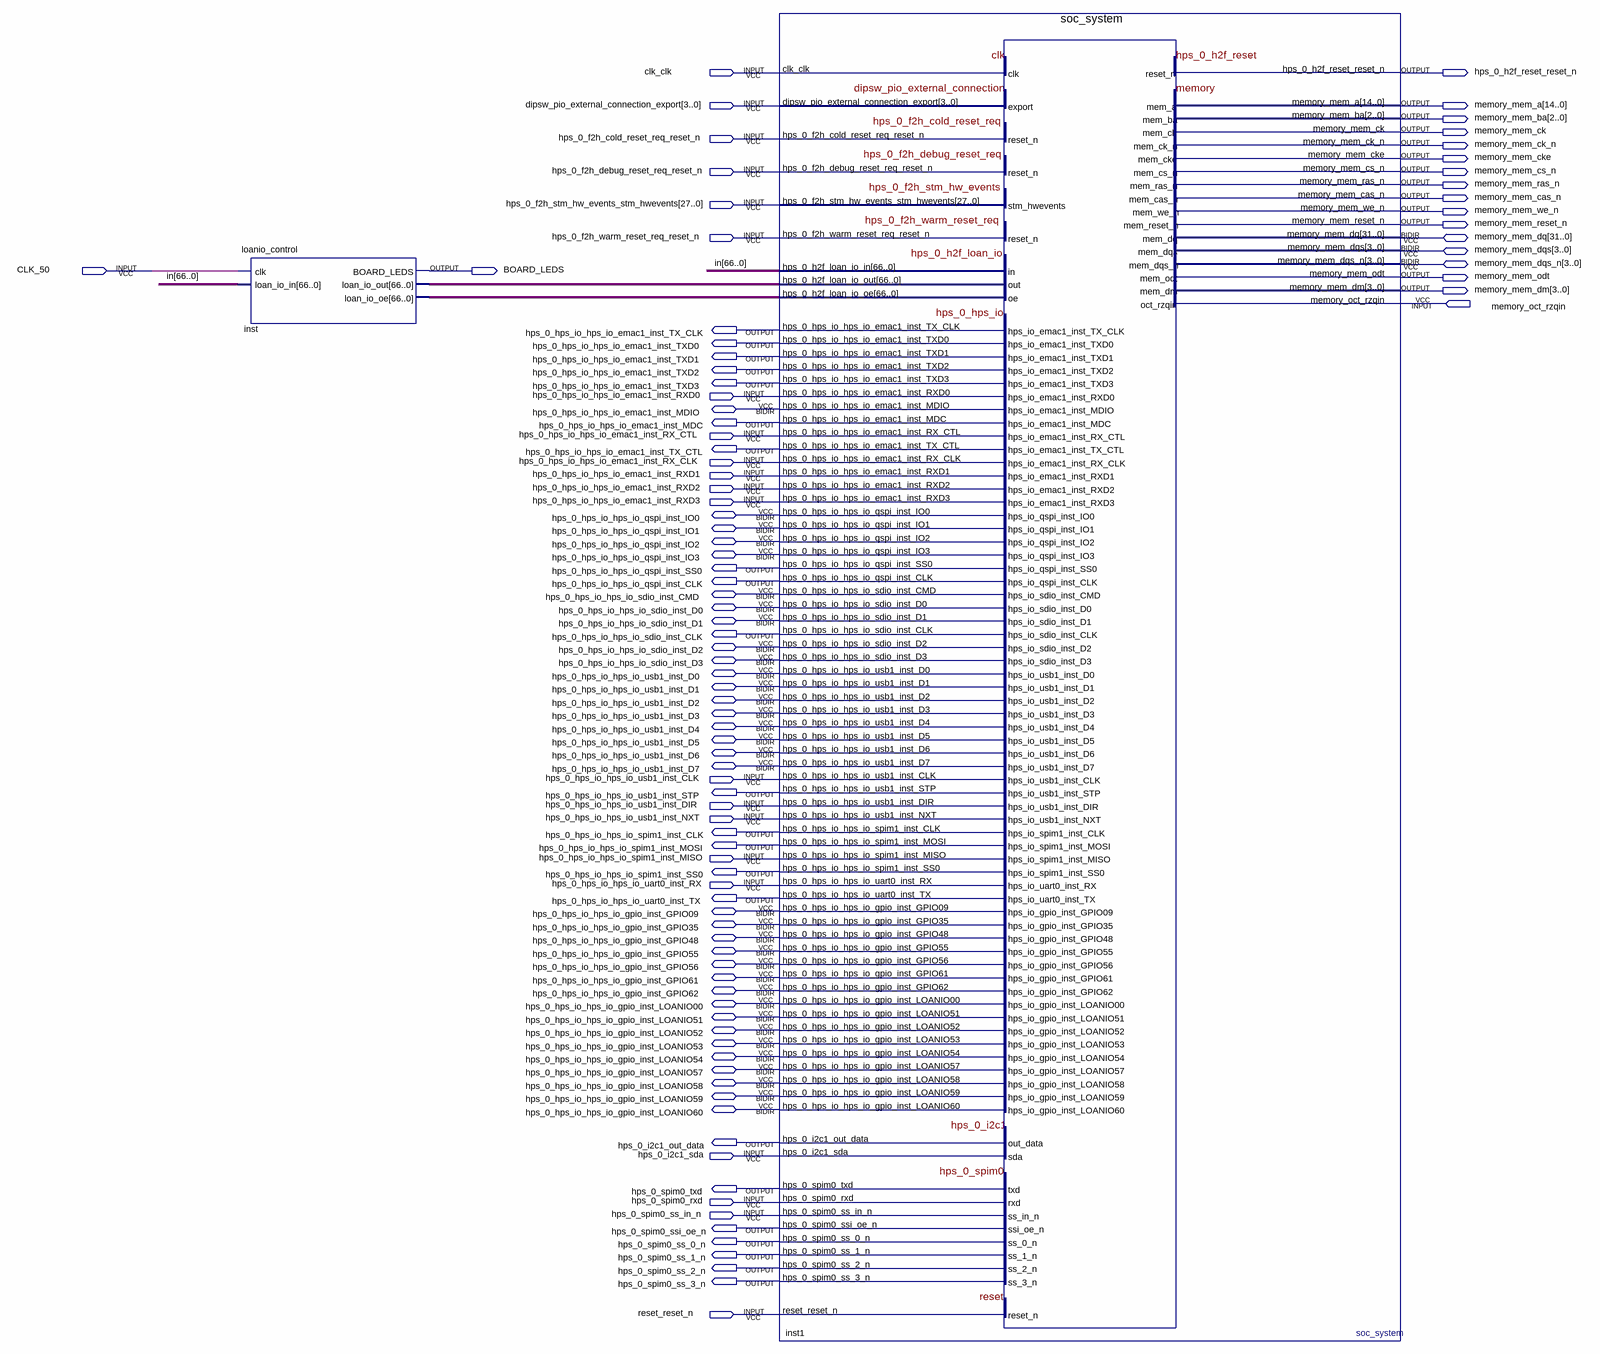
[diagram p0: schematic sheet]
// Quartus schematic gpio_expander.bdf as structural Verilog: 2 symbols, 96 pins
module gpio_expander (
  input  clk_clk,
  input  [3:0] dipsw_pio_external_connection_export,
  input  hps_0_f2h_cold_reset_req_reset_n,
  input  hps_0_f2h_debug_reset_req_reset_n,
  input  [27:0] hps_0_f2h_stm_hw_events_stm_hwevents,
  input  hps_0_f2h_warm_reset_req_reset_n,
  input  CLK_50,
  input  memory_oct_rzqin,
  input  hps_0_hps_io_hps_io_emac1_inst_RXD0,
  input  hps_0_hps_io_hps_io_emac1_inst_RX_CTL,
  input  hps_0_hps_io_hps_io_emac1_inst_RX_CLK,
  input  hps_0_hps_io_hps_io_emac1_inst_RXD1,
  input  hps_0_hps_io_hps_io_emac1_inst_RXD2,
  input  hps_0_hps_io_hps_io_emac1_inst_RXD3,
  input  hps_0_hps_io_hps_io_usb1_inst_CLK,
  input  hps_0_hps_io_hps_io_usb1_inst_DIR,
  input  hps_0_hps_io_hps_io_usb1_inst_NXT,
  input  hps_0_hps_io_hps_io_spim1_inst_MISO,
  input  hps_0_hps_io_hps_io_uart0_inst_RX,
  input  hps_0_i2c1_sda,
  input  hps_0_spim0_rxd,
  input  hps_0_spim0_ss_in_n,
  input  reset_reset_n,
  inout  [31:0] memory_mem_dq,
  inout  [3:0] memory_mem_dqs,
  inout  [3:0] memory_mem_dqs_n,
  inout  hps_0_hps_io_hps_io_emac1_inst_MDIO,
  inout  hps_0_hps_io_hps_io_qspi_inst_IO0,
  inout  hps_0_hps_io_hps_io_qspi_inst_IO1,
  inout  hps_0_hps_io_hps_io_qspi_inst_IO2,
  inout  hps_0_hps_io_hps_io_qspi_inst_IO3,
  inout  hps_0_hps_io_hps_io_sdio_inst_CMD,
  inout  hps_0_hps_io_hps_io_sdio_inst_D0,
  inout  hps_0_hps_io_hps_io_sdio_inst_D1,
  inout  hps_0_hps_io_hps_io_sdio_inst_D2,
  inout  hps_0_hps_io_hps_io_sdio_inst_D3,
  inout  hps_0_hps_io_hps_io_usb1_inst_D0,
  inout  hps_0_hps_io_hps_io_usb1_inst_D1,
  inout  hps_0_hps_io_hps_io_usb1_inst_D2,
  inout  hps_0_hps_io_hps_io_usb1_inst_D3,
  inout  hps_0_hps_io_hps_io_usb1_inst_D4,
  inout  hps_0_hps_io_hps_io_usb1_inst_D5,
  inout  hps_0_hps_io_hps_io_usb1_inst_D6,
  inout  hps_0_hps_io_hps_io_usb1_inst_D7,
  inout  hps_0_hps_io_hps_io_gpio_inst_GPIO09,
  inout  hps_0_hps_io_hps_io_gpio_inst_GPIO35,
  inout  hps_0_hps_io_hps_io_gpio_inst_GPIO48,
  inout  hps_0_hps_io_hps_io_gpio_inst_GPIO55,
  inout  hps_0_hps_io_hps_io_gpio_inst_GPIO56,
  inout  hps_0_hps_io_hps_io_gpio_inst_GPIO61,
  inout  hps_0_hps_io_hps_io_gpio_inst_GPIO62,
  inout  hps_0_hps_io_hps_io_gpio_inst_LOANIO00,
  inout  hps_0_hps_io_hps_io_gpio_inst_LOANIO51,
  inout  hps_0_hps_io_hps_io_gpio_inst_LOANIO52,
  inout  hps_0_hps_io_hps_io_gpio_inst_LOANIO53,
  inout  hps_0_hps_io_hps_io_gpio_inst_LOANIO54,
  inout  hps_0_hps_io_hps_io_gpio_inst_LOANIO57,
  inout  hps_0_hps_io_hps_io_gpio_inst_LOANIO58,
  inout  hps_0_hps_io_hps_io_gpio_inst_LOANIO59,
  inout  hps_0_hps_io_hps_io_gpio_inst_LOANIO60,
  output hps_0_h2f_reset_reset_n,
  output [14:0] memory_mem_a,
  output [2:0] memory_mem_ba,
  output memory_mem_ck,
  output memory_mem_ck_n,
  output memory_mem_cke,
  output memory_mem_cs_n,
  output memory_mem_ras_n,
  output memory_mem_cas_n,
  output memory_mem_we_n,
  output memory_mem_reset_n,
  output BOARD_LEDS,
  output memory_mem_odt,
  output [3:0] memory_mem_dm,
  output hps_0_hps_io_hps_io_emac1_inst_TX_CLK,
  output hps_0_hps_io_hps_io_emac1_inst_TXD0,
  output hps_0_hps_io_hps_io_emac1_inst_TXD1,
  output hps_0_hps_io_hps_io_emac1_inst_TXD2,
  output hps_0_hps_io_hps_io_emac1_inst_TXD3,
  output hps_0_hps_io_hps_io_emac1_inst_MDC,
  output hps_0_hps_io_hps_io_emac1_inst_TX_CTL,
  output hps_0_hps_io_hps_io_qspi_inst_SS0,
  output hps_0_hps_io_hps_io_qspi_inst_CLK,
  output hps_0_hps_io_hps_io_sdio_inst_CLK,
  output hps_0_hps_io_hps_io_usb1_inst_STP,
  output hps_0_hps_io_hps_io_spim1_inst_CLK,
  output hps_0_hps_io_hps_io_spim1_inst_MOSI,
  output hps_0_hps_io_hps_io_spim1_inst_SS0,
  output hps_0_hps_io_hps_io_uart0_inst_TX,
  output hps_0_i2c1_out_data,
  output hps_0_spim0_txd,
  output hps_0_spim0_ssi_oe_n,
  output hps_0_spim0_ss_0_n,
  output hps_0_spim0_ss_1_n,
  output hps_0_spim0_ss_2_n,
  output hps_0_spim0_ss_3_n
);

  wire [66:0] in, inst_loan_io_oe, inst_loan_io_out;

  loanio_control inst (
    .clk(CLK_50), .loan_io_in(in), .BOARD_LEDS(BOARD_LEDS), .loan_io_out(inst_loan_io_out),
    .loan_io_oe(inst_loan_io_oe));
  soc_system inst1 (
    .clk_clk(clk_clk), .dipsw_pio_external_connection_export(dipsw_pio_external_connection_export),
    .hps_0_f2h_cold_reset_req_reset_n(hps_0_f2h_cold_reset_req_reset_n),
    .hps_0_f2h_debug_reset_req_reset_n(hps_0_f2h_debug_reset_req_reset_n),
    .hps_0_f2h_stm_hw_events_stm_hwevents(hps_0_f2h_stm_hw_events_stm_hwevents),
    .hps_0_f2h_warm_reset_req_reset_n(hps_0_f2h_warm_reset_req_reset_n),
    .hps_0_h2f_loan_io_out(inst_loan_io_out), .hps_0_h2f_loan_io_oe(inst_loan_io_oe),
    .hps_0_hps_io_hps_io_emac1_inst_RXD0(hps_0_hps_io_hps_io_emac1_inst_RXD0),
    .hps_0_hps_io_hps_io_emac1_inst_RX_CTL(hps_0_hps_io_hps_io_emac1_inst_RX_CTL),
    .hps_0_hps_io_hps_io_emac1_inst_RX_CLK(hps_0_hps_io_hps_io_emac1_inst_RX_CLK),
    .hps_0_hps_io_hps_io_emac1_inst_RXD1(hps_0_hps_io_hps_io_emac1_inst_RXD1),
    .hps_0_hps_io_hps_io_emac1_inst_RXD2(hps_0_hps_io_hps_io_emac1_inst_RXD2),
    .hps_0_hps_io_hps_io_emac1_inst_RXD3(hps_0_hps_io_hps_io_emac1_inst_RXD3),
    .hps_0_hps_io_hps_io_usb1_inst_CLK(hps_0_hps_io_hps_io_usb1_inst_CLK),
    .hps_0_hps_io_hps_io_usb1_inst_DIR(hps_0_hps_io_hps_io_usb1_inst_DIR),
    .hps_0_hps_io_hps_io_usb1_inst_NXT(hps_0_hps_io_hps_io_usb1_inst_NXT),
    .hps_0_hps_io_hps_io_spim1_inst_MISO(hps_0_hps_io_hps_io_spim1_inst_MISO),
    .hps_0_hps_io_hps_io_uart0_inst_RX(hps_0_hps_io_hps_io_uart0_inst_RX), .hps_0_i2c1_sda(hps_0_i2c1_sda),
    .hps_0_spim0_rxd(hps_0_spim0_rxd), .hps_0_spim0_ss_in_n(hps_0_spim0_ss_in_n),
    .memory_oct_rzqin(memory_oct_rzqin), .reset_reset_n(reset_reset_n), .hps_0_h2f_loan_io_in(in),
    .hps_0_h2f_reset_reset_n(hps_0_h2f_reset_reset_n),
    .hps_0_hps_io_hps_io_emac1_inst_TX_CLK(hps_0_hps_io_hps_io_emac1_inst_TX_CLK),
    .hps_0_hps_io_hps_io_emac1_inst_TXD0(hps_0_hps_io_hps_io_emac1_inst_TXD0),
    .hps_0_hps_io_hps_io_emac1_inst_TXD1(hps_0_hps_io_hps_io_emac1_inst_TXD1),
    .hps_0_hps_io_hps_io_emac1_inst_TXD2(hps_0_hps_io_hps_io_emac1_inst_TXD2),
    .hps_0_hps_io_hps_io_emac1_inst_TXD3(hps_0_hps_io_hps_io_emac1_inst_TXD3),
    .hps_0_hps_io_hps_io_emac1_inst_MDC(hps_0_hps_io_hps_io_emac1_inst_MDC),
    .hps_0_hps_io_hps_io_emac1_inst_TX_CTL(hps_0_hps_io_hps_io_emac1_inst_TX_CTL),
    .hps_0_hps_io_hps_io_qspi_inst_SS0(hps_0_hps_io_hps_io_qspi_inst_SS0),
    .hps_0_hps_io_hps_io_qspi_inst_CLK(hps_0_hps_io_hps_io_qspi_inst_CLK),
    .hps_0_hps_io_hps_io_sdio_inst_CLK(hps_0_hps_io_hps_io_sdio_inst_CLK),
    .hps_0_hps_io_hps_io_usb1_inst_STP(hps_0_hps_io_hps_io_usb1_inst_STP),
    .hps_0_hps_io_hps_io_spim1_inst_CLK(hps_0_hps_io_hps_io_spim1_inst_CLK),
    .hps_0_hps_io_hps_io_spim1_inst_MOSI(hps_0_hps_io_hps_io_spim1_inst_MOSI),
    .hps_0_hps_io_hps_io_spim1_inst_SS0(hps_0_hps_io_hps_io_spim1_inst_SS0),
    .hps_0_hps_io_hps_io_uart0_inst_TX(hps_0_hps_io_hps_io_uart0_inst_TX),
    .hps_0_i2c1_out_data(hps_0_i2c1_out_data), .hps_0_spim0_txd(hps_0_spim0_txd),
    .hps_0_spim0_ssi_oe_n(hps_0_spim0_ssi_oe_n), .hps_0_spim0_ss_0_n(hps_0_spim0_ss_0_n),
    .hps_0_spim0_ss_1_n(hps_0_spim0_ss_1_n), .hps_0_spim0_ss_2_n(hps_0_spim0_ss_2_n),
    .hps_0_spim0_ss_3_n(hps_0_spim0_ss_3_n), .memory_mem_a(memory_mem_a), .memory_mem_ba(memory_mem_ba),
    .memory_mem_ck(memory_mem_ck), .memory_mem_ck_n(memory_mem_ck_n), .memory_mem_cke(memory_mem_cke),
    .memory_mem_cs_n(memory_mem_cs_n), .memory_mem_ras_n(memory_mem_ras_n),
    .memory_mem_cas_n(memory_mem_cas_n), .memory_mem_we_n(memory_mem_we_n),
    .memory_mem_reset_n(memory_mem_reset_n), .memory_mem_odt(memory_mem_odt), .memory_mem_dm(memory_mem_dm),
    .hps_0_hps_io_hps_io_emac1_inst_MDIO(hps_0_hps_io_hps_io_emac1_inst_MDIO),
    .hps_0_hps_io_hps_io_qspi_inst_IO0(hps_0_hps_io_hps_io_qspi_inst_IO0),
    .hps_0_hps_io_hps_io_qspi_inst_IO1(hps_0_hps_io_hps_io_qspi_inst_IO1),
    .hps_0_hps_io_hps_io_qspi_inst_IO2(hps_0_hps_io_hps_io_qspi_inst_IO2),
    .hps_0_hps_io_hps_io_qspi_inst_IO3(hps_0_hps_io_hps_io_qspi_inst_IO3),
    .hps_0_hps_io_hps_io_sdio_inst_CMD(hps_0_hps_io_hps_io_sdio_inst_CMD),
    .hps_0_hps_io_hps_io_sdio_inst_D0(hps_0_hps_io_hps_io_sdio_inst_D0),
    .hps_0_hps_io_hps_io_sdio_inst_D1(hps_0_hps_io_hps_io_sdio_inst_D1),
    .hps_0_hps_io_hps_io_sdio_inst_D2(hps_0_hps_io_hps_io_sdio_inst_D2),
    .hps_0_hps_io_hps_io_sdio_inst_D3(hps_0_hps_io_hps_io_sdio_inst_D3),
    .hps_0_hps_io_hps_io_usb1_inst_D0(hps_0_hps_io_hps_io_usb1_inst_D0),
    .hps_0_hps_io_hps_io_usb1_inst_D1(hps_0_hps_io_hps_io_usb1_inst_D1),
    .hps_0_hps_io_hps_io_usb1_inst_D2(hps_0_hps_io_hps_io_usb1_inst_D2),
    .hps_0_hps_io_hps_io_usb1_inst_D3(hps_0_hps_io_hps_io_usb1_inst_D3),
    .hps_0_hps_io_hps_io_usb1_inst_D4(hps_0_hps_io_hps_io_usb1_inst_D4),
    .hps_0_hps_io_hps_io_usb1_inst_D5(hps_0_hps_io_hps_io_usb1_inst_D5),
    .hps_0_hps_io_hps_io_usb1_inst_D6(hps_0_hps_io_hps_io_usb1_inst_D6),
    .hps_0_hps_io_hps_io_usb1_inst_D7(hps_0_hps_io_hps_io_usb1_inst_D7),
    .hps_0_hps_io_hps_io_gpio_inst_GPIO09(hps_0_hps_io_hps_io_gpio_inst_GPIO09),
    .hps_0_hps_io_hps_io_gpio_inst_GPIO35(hps_0_hps_io_hps_io_gpio_inst_GPIO35),
    .hps_0_hps_io_hps_io_gpio_inst_GPIO48(hps_0_hps_io_hps_io_gpio_inst_GPIO48),
    .hps_0_hps_io_hps_io_gpio_inst_GPIO55(hps_0_hps_io_hps_io_gpio_inst_GPIO55),
    .hps_0_hps_io_hps_io_gpio_inst_GPIO56(hps_0_hps_io_hps_io_gpio_inst_GPIO56),
    .hps_0_hps_io_hps_io_gpio_inst_GPIO61(hps_0_hps_io_hps_io_gpio_inst_GPIO61),
    .hps_0_hps_io_hps_io_gpio_inst_GPIO62(hps_0_hps_io_hps_io_gpio_inst_GPIO62),
    .hps_0_hps_io_hps_io_gpio_inst_LOANIO00(hps_0_hps_io_hps_io_gpio_inst_LOANIO00),
    .hps_0_hps_io_hps_io_gpio_inst_LOANIO51(hps_0_hps_io_hps_io_gpio_inst_LOANIO51),
    .hps_0_hps_io_hps_io_gpio_inst_LOANIO52(hps_0_hps_io_hps_io_gpio_inst_LOANIO52),
    .hps_0_hps_io_hps_io_gpio_inst_LOANIO53(hps_0_hps_io_hps_io_gpio_inst_LOANIO53),
    .hps_0_hps_io_hps_io_gpio_inst_LOANIO54(hps_0_hps_io_hps_io_gpio_inst_LOANIO54),
    .hps_0_hps_io_hps_io_gpio_inst_LOANIO57(hps_0_hps_io_hps_io_gpio_inst_LOANIO57),
    .hps_0_hps_io_hps_io_gpio_inst_LOANIO58(hps_0_hps_io_hps_io_gpio_inst_LOANIO58),
    .hps_0_hps_io_hps_io_gpio_inst_LOANIO59(hps_0_hps_io_hps_io_gpio_inst_LOANIO59),
    .hps_0_hps_io_hps_io_gpio_inst_LOANIO60(hps_0_hps_io_hps_io_gpio_inst_LOANIO60),
    .memory_mem_dq(memory_mem_dq), .memory_mem_dqs(memory_mem_dqs), .memory_mem_dqs_n(memory_mem_dqs_n));
endmodule
